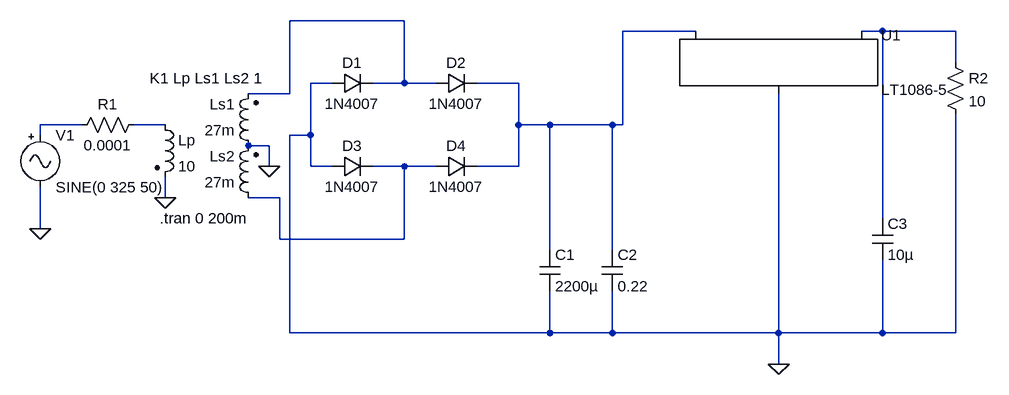
[diagram p0: schematic dc_power.asc]
dc_power.asc, the LTspice schematic file:
Version 4.1
SHEET 1 1684 680
WIRE 768 -64 592 -64
WIRE 1216 -48 1104 -48
WIRE 1504 -48 1472 -48
WIRE 1616 -48 1504 -48
WIRE 1616 0 1616 -48
WIRE 656 32 624 32
WIRE 768 32 768 -64
WIRE 768 32 720 32
WIRE 816 32 768 32
WIRE 944 32 880 32
WIRE 592 48 592 -64
WIRE 592 48 528 48
WIRE 272 96 208 96
WIRE 400 96 352 96
WIRE 944 96 944 32
WIRE 992 96 944 96
WIRE 1088 96 992 96
WIRE 1104 96 1104 -48
WIRE 1104 96 1088 96
WIRE 208 112 208 96
WIRE 624 112 624 32
WIRE 624 112 592 112
WIRE 560 128 528 128
WIRE 560 160 560 128
WIRE 624 160 624 112
WIRE 656 160 624 160
WIRE 768 160 720 160
WIRE 816 160 768 160
WIRE 944 160 944 96
WIRE 944 160 880 160
WIRE 400 208 400 176
WIRE 576 208 528 208
WIRE 1504 240 1504 -48
WIRE 208 256 208 192
WIRE 576 272 576 208
WIRE 768 272 768 160
WIRE 768 272 576 272
WIRE 992 288 992 96
WIRE 1088 288 1088 96
WIRE 592 416 592 112
WIRE 992 416 992 352
WIRE 992 416 592 416
WIRE 1088 416 1088 352
WIRE 1088 416 992 416
WIRE 1344 416 1344 48
WIRE 1344 416 1088 416
WIRE 1504 416 1504 304
WIRE 1504 416 1344 416
WIRE 1616 416 1616 80
WIRE 1616 416 1504 416
WIRE 1344 464 1344 416
FLAG 208 256 0
FLAG 400 208 0
FLAG 1344 464 0
FLAG 560 160 0
DATAFLAG 576 240 ""
SYMBOL ind2 384 80 R0
SYMATTR InstName Lp
SYMATTR Value 10
SYMBOL ind2 544 144 R180
WINDOW 0 36 80 Left 2
WINDOW 3 36 40 Left 2
SYMATTR InstName Ls1
SYMATTR Value 27m
SYMBOL ind2 544 224 R180
WINDOW 0 36 80 Left 2
WINDOW 3 36 40 Left 2
SYMATTR InstName Ls2
SYMATTR Value 27m
SYMBOL diode 656 48 R270
WINDOW 0 32 32 VTop 2
WINDOW 3 0 32 VBottom 2
SYMATTR InstName D1
SYMATTR Value 1N4007
SYMBOL diode 816 48 R270
WINDOW 0 32 32 VTop 2
WINDOW 3 0 32 VBottom 2
SYMATTR InstName D2
SYMATTR Value 1N4007
SYMBOL diode 656 176 R270
WINDOW 0 32 32 VTop 2
WINDOW 3 0 32 VBottom 2
SYMATTR InstName D3
SYMATTR Value 1N4007
SYMBOL diode 816 176 R270
WINDOW 0 32 32 VTop 2
WINDOW 3 0 32 VBottom 2
SYMATTR InstName D4
SYMATTR Value 1N4007
SYMBOL cap 1488 240 R0
SYMATTR InstName C3
SYMATTR Value 10µ
SYMBOL PowerProducts\\LT1086-5 1344 -48 R0
SYMATTR InstName U1
SYMBOL cap 976 288 R0
SYMATTR InstName C1
SYMATTR Value 2200µ
SYMBOL cap 1072 288 R0
SYMATTR InstName C2
SYMATTR Value 0.22
SYMBOL res 368 80 R90
WINDOW 0 0 56 VBottom 2
WINDOW 3 32 56 VTop 2
SYMATTR InstName R1
SYMATTR Value 0.0001
SYMBOL Misc\\signal 208 96 R0
SYMATTR InstName V1
SYMATTR Value SINE(0 325 50)
SYMBOL res 1600 -16 R0
SYMATTR InstName R2
SYMATTR Value 10
TEXT 392 240 Left 2 !.tran 0 200m
TEXT 376 24 Left 2 !K1 Lp Ls1 Ls2 1

The netlist it stands for:
* dc_power.asc
Lp N005 0 10
Ls1 0 N001 27m
Ls2 N006 0 27m
D1 0 N001 1N4007
D2 N001 N002 1N4007
D3 0 N006 1N4007
D4 N006 N002 1N4007
C3 N003 0 10µ
X§U1 0 N003 N002 LT1086-5
C1 N002 0 2200µ
C2 N002 0 0.22
R1 N005 N004 0.0001
V1 N004 0 SINE(0 325 50)
R2 N003 0 10
.model D D
.lib standard.dio
.tran 0 200m
K1 Lp Ls1 Ls2 1
.backanno
.end